# EAGLE design ac-timer (EAGLE 9.6.2)
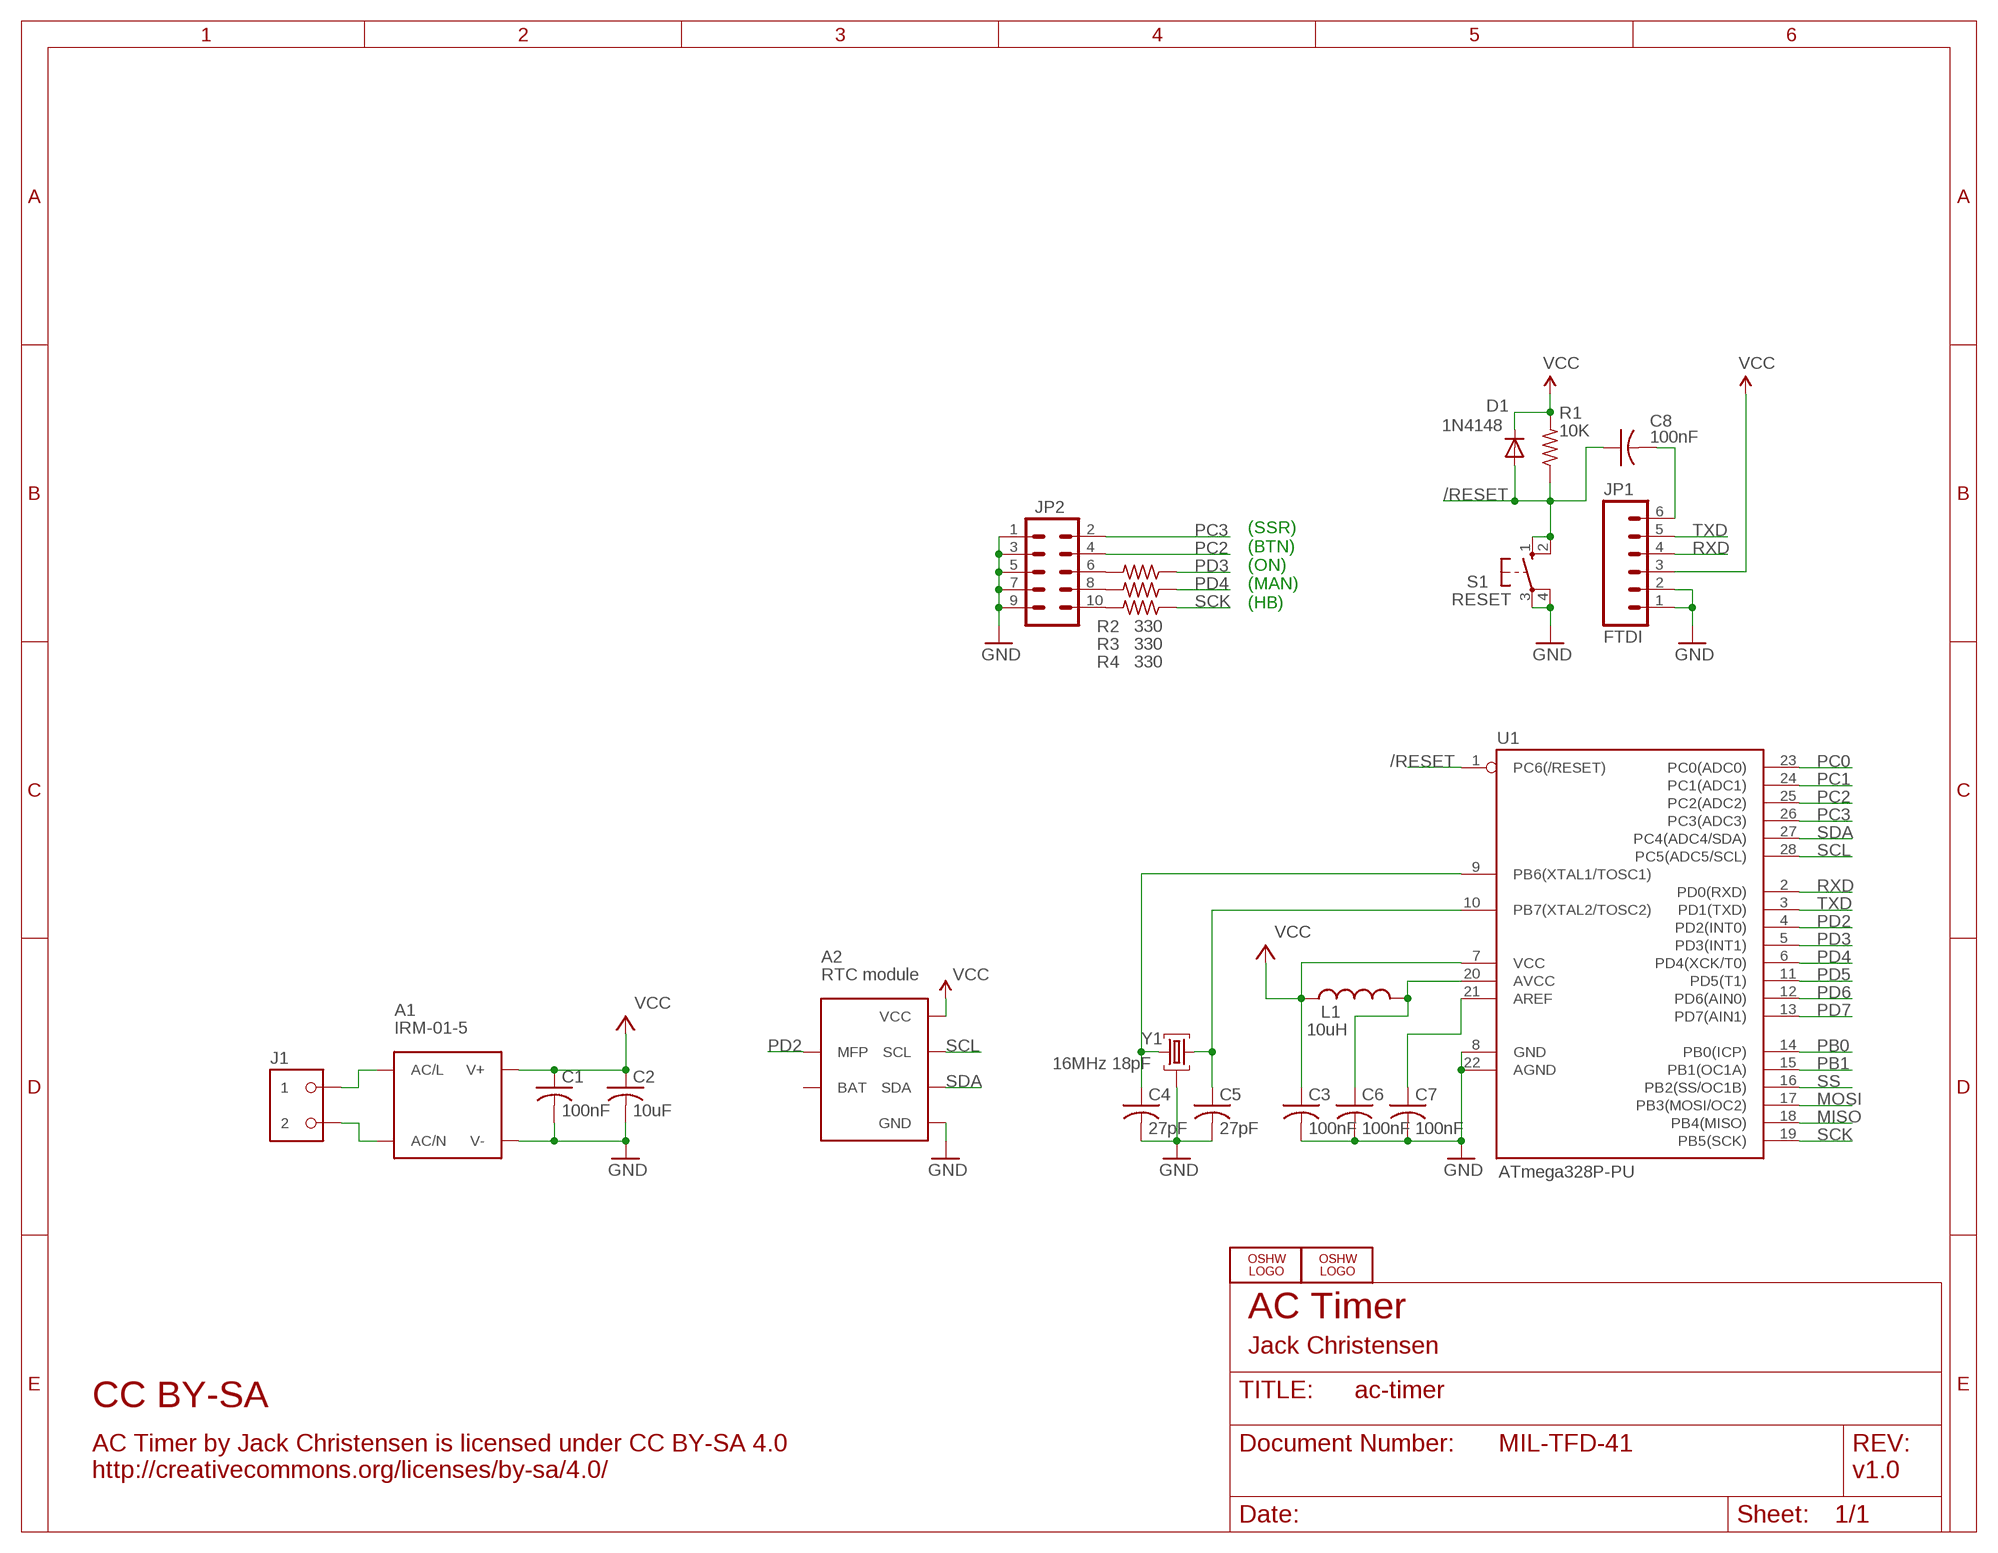
[diagram p0: schematic, sheet 1]

## Parts
A1  IRM-01-5  IRM-01  [IRM-01]
A2  RTC module  RTC79412  [RTC79412]
C1  100nF  C-USM0805  [M0805]
C2  10uF  C-USM0805  [M0805]
C3  100nF  C-USM0805  [M0805]
C4  27pF  C-USM0805  [M0805]
C5  27pF  C-USM0805  [M0805]
C6  100nF  C-USM0805  [M0805]
C7  100nF  C-USM0805  [M0805]
C8  100nF  C-USM0805  [M0805]
D1  1N4148  DIODESOD-323F  [SOD-323F]
J1  OST-TB-20.20IN  [OST-TB-2-0.20]
JP1  FTDI  M06LOCK  [1X06_LOCK]
JP2  M05X2PTH  [AVR_ICSP]
L1  10uH  INDUCTORM0805  [M0805]
LOGO1  OSHW_LOGO_8MILX0100-NT  [OSHW_8X100_NOTEXT]
LOGO2  OSHW_LOGO_8MILX0100-NT  [OSHW_8X100_NOTEXT]
R1  10K  R-US_M0805  [M0805]
R2  330  R-US_M0805  [M0805]
R3  330  R-US_M0805  [M0805]
R4  330  R-US_M0805  [M0805]
S1  RESET  10-XXOCT  [B3F-10XXOCT]
U1  ATmega328P-PU  AVR-MEGA8-PPTH  [DIL28-3]
Y1  16MHz 18pF  RESONATOR  [RESONATOR]

## Nets
/RESET: C8.1 D1.A R1.1 S1.1(S) S1.2(S1) U1.1(PC6(/RESET))
GND: A1.V- A2.8(GND) C1.2 C2.2 C3.2 C4.2 C5.2 C6.2 C7.2 JP1.1 JP1.2 JP2.1 JP2.3 JP2.5 JP2.7 JP2.9 S1.3(P) S1.4(P1) U1.8(GND) U1.22(AGND) Y1.2
MISO: U1.18(PB4(MISO))
MOSI: U1.17(PB3(MOSI/OC2))
N$1: JP2.10 R4.2
N$2: JP2.8 R3.2
N$3: JP2.6 R2.2
N$4: C5.1 U1.10(PB7(XTAL2/TOSC2)) Y1.3
N$5: C6.1 L1.2 U1.20(AVCC)
N$6: C4.1 U1.9(PB6(XTAL1/TOSC1)) Y1.1
N$7: C7.1 U1.21(AREF)
N$8: A1.AC/N J1.P$2
N$9: A1.AC/L J1.P$1
PB0: U1.14(PB0(ICP))
PB1: U1.15(PB1(OC1A))
PC0: U1.23(PC0(ADC0))
PC1: U1.24(PC1(ADC1))
PC2: JP2.4 U1.25(PC2(ADC2))
PC3: JP2.2 U1.26(PC3(ADC3))
PD2: A2.3(MFP) U1.4(PD2(INT0))
PD3: R2.1 U1.5(PD3(INT1))
PD4: R3.1 U1.6(PD4(XCK/T0))
PD5: U1.11(PD5(T1))
PD6: U1.12(PD6(AIN0))
PD7: U1.13(PD7(AIN1))
RST: C8.2 JP1.6
RXD: JP1.4 U1.2(PD0(RXD))
SCK: R4.1 U1.19(PB5(SCK))
SCL: A2.6(SCL) U1.28(PC5(ADC5/SCL))
SDA: A2.5(SDA) U1.27(PC4(ADC4/SDA))
SS: U1.16(PB2(SS/OC1B))
TXD: JP1.5 U1.3(PD1(TXD))
VCC: A1.V+ A2.7(VCC) C1.1 C2.1 C3.1 D1.K JP1.3 L1.1 R1.2 U1.7(VCC)
Unconnected: A2.1(BAT)

## Notes on the sheet
- (SSR)
  (BTN)
  (ON)
  (MAN)
  (HB)
- AC Timer
- Jack Christensen
- CC BY-SA
- MIL-TFD-41
- AC Timer by Jack Christensen is licensed under CC BY-SA 4.0
  http://creativecommons.org/licenses/by-sa/4.0/
- v1.0

## Library data of the parts
A1 = _jc:IRM-01: Mean Well IRM-01 series 1W encapsulated power supply module.
A2 = _jc:RTC79412
C1-C8 = _jc:C-US: CAPACITOR, American symbol
D1 = _jc:DIODE
J1 = _jc:OST-TB-2
JP1 = SparkFun:M06: Header 6 Standard 6-pin 0.1" header. Use with straight break away headers (SKU : PRT-00116), right angle break away headers (PRT-00553), swiss pins (PRT-00743), machine pins (PRT-00117), and female headers (PRT-00115). Molex polarized connector foot print use with SKU : PRT-08094 with associated crimp pins and housings. NOTES ON THE VARIANTS LOCK and LOCK_LONGPADS... This footprint was designed to help hold the alignment of a through-hole component (i.e. 6-pin header) while soldering it into place. You may notice that each hole has been shifted either up or down by 0.005 of an inch from it's more standard position (which is a perfectly straight line). This slight alteration caused the pins (the squares in the middle) to touch the edges of the holes. Because they are alternating, it causes a "brace" to hold the component in place. 0.005 has proven to be the perfect amount of "off-center" position when using our standard breakaway headers. Although looks a little odd when you look at the bare footprint, once you have a header in there, the alteration is very hard to notice. Also, if you push a header all the way into place, it is covered up entirely on the bottom side. This idea of altering the position of holes to aid alignment will be further integrated into the Sparkfun Library for other footprints. It can help hold any component with 3 or more connection pins.
JP2 = SparkFun:M05X2: Header 5x2 Standard 10-pin dual row 0.1" header. Commonly used with AVR-ISP. Use with Spark Fun Electronics SKU: PRT-00778
L1 = _jc:INDUCTOR: Murata #11R472C
LOGO1 LOGO2 = ohw-logo:OSHW_LOGO_8MIL
R1-R4 = _jc:R-US_: RESISTOR, American symbol
S1 = _jc:10-XX: OMRON SWITCH
U1 = SparkFun:AVR-MEGA8-P: MICROCONTROLLER 8 Kbytes FLASH 1 kbytes SRAM 512 bytes EEPROM USART 4-channel 10 bit ADC 2-channel 8 bit ADC
Y1 = _jc:RESONATOR: Ceramic resonator with capacitors or HC49/US crystal

## Board
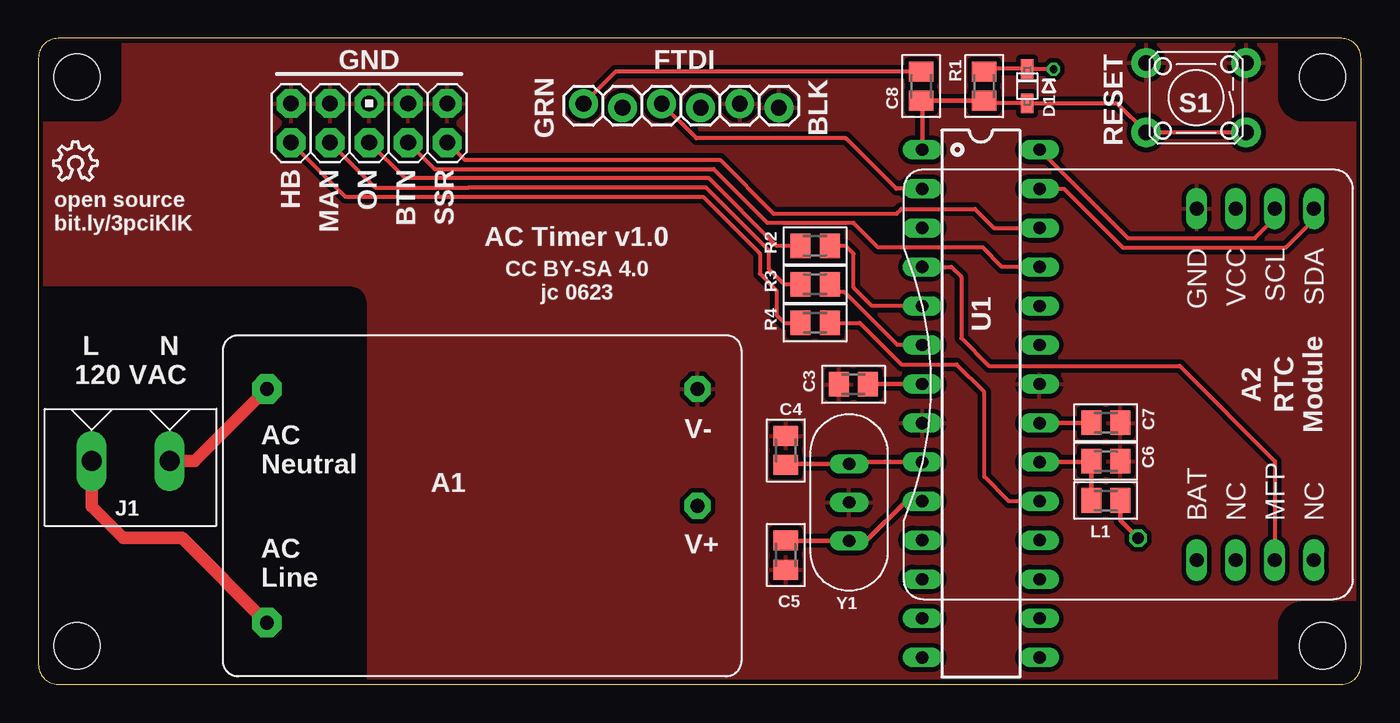
[diagram p1: board, top side]
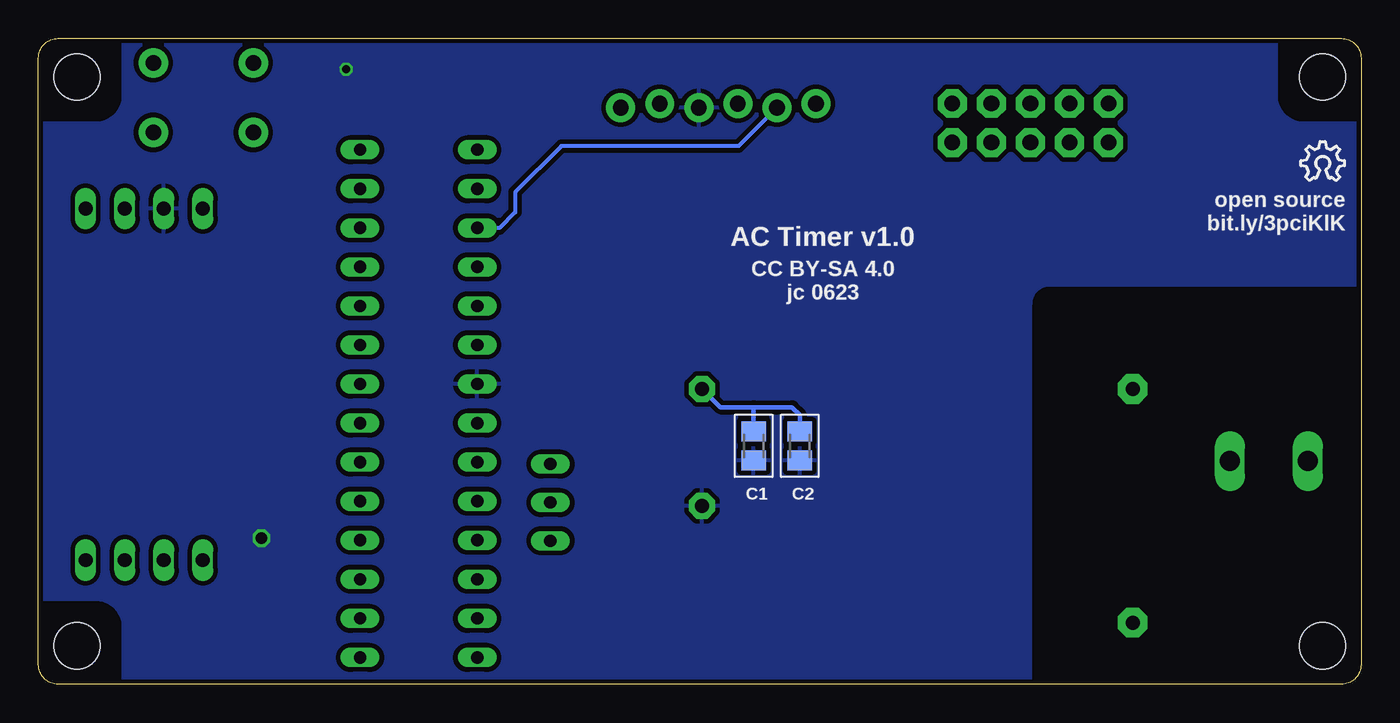
[diagram p2: board, bottom side, seen from below]

Size 86 x 42 mm. Coordinates in mm from the lower left corner, seen from the top.
Outline: 1.27,0 84.73,0 arc90 86,1.27 86,40.73 arc90 84.73,42 1.27,42 arc90 0,40.73 0,1.27 arc90 1.27,0
Copper layers (1*16): Top 0.0356mm / dielectric 1.5011mm / Bottom 0.0356mm
Design rules "oshpark-2layer-jc": minimum track width 8mil, minimum drill 13mil, track to track 8mil, track to pad 8mil, pad to pad 8mil, via to via 8mil, smd to smd 6mil, copper to edge 12mil, drill to drill 6mil, minimum pad ring 7mil, minimum via ring 7mil, stop-mask expansion 2.5mil, vias tented up to drill 20mil, thermal gap 12mil
Holes 3 mm at 2.5,2.5 2.5,39.5 83.5,39.5 83.5,2.5
tRestrict: area 81,37 to 86,42; area 81,0 to 86,5; area 0,37 to 5,42
bRestrict: area 0,37 to 5,42; area 81,0 to 86,5; area 81,37 to 86,42

### Footprints (pad centres in the part's own frame; a part is rotated, then mirrored left to right if it is on the bottom)
IRM-01 = drill 0.9 pad 1.93 octagon: AC/L 2.85,3.5; AC/N 2.85,18.7 | drill 0.9 pad 1.676 octagon: V+ 30.85,11.1; V- 30.85,18.7
RTC79412 = drill 0.9 long: 1 -11.43,-3.81; 2 -11.43,-6.35; 3 -11.43,-8.89; 4 -11.43,-11.43; 5 11.43,-11.43; 6 11.43,-8.89; 7 11.43,-6.35; 8 11.43,-3.81
M0805 = smd 1.3 x 1.6: 1 -0.95,0; 2 0.95,0
SOD-323F = smd 1.27 x 0.813: A -1.118,0; K 1.118,0
OST-TB-2-0.20 = drill 1.3 long: P$1 2.548,-0.009; P$2 -2.532,-0.009
1X06_LOCK = drill 1.016 pad 1.88: 1 0,0; 2 2.54,-0.254; 3 5.08,0; 4 7.62,-0.254; 5 10.16,0; 6 12.7,-0.254
AVR_ICSP = drill 1.016 pad 1.88 octagon: 1 -1.27,5.08; 2 1.27,5.08; 3 -1.27,2.54; 4 1.27,2.54; 5 -1.27,0; 6 1.27,0; 7 -1.27,-2.54; 8 1.27,-2.54; 9 -1.27,-5.08; 10 1.27,-5.08
B3F-10XXOCT = drill 1.016 pad 1.93: 1 -3.251,2.261; 2 3.251,2.261; 3 -3.251,-2.261; 4 3.251,-2.261
DIL28-3 = drill 0.8 pad 1.27 long: 1 -16.51,-3.81; 2 -13.97,-3.81; 3 -11.43,-3.81; 4 -8.89,-3.81; 5 -6.35,-3.81; 6 -3.81,-3.81; 7 -1.27,-3.81; 8 1.27,-3.81; 9 3.81,-3.81; 10 6.35,-3.81; 11 8.89,-3.81; 12 11.43,-3.81; 13 13.97,-3.81; 14 16.51,-3.81; 15 16.51,3.81; 16 13.97,3.81; 17 11.43,3.81; 18 8.89,3.81; 19 6.35,3.81; 20 3.81,3.81; 21 1.27,3.81; 22 -1.27,3.81; 23 -3.81,3.81; 24 -6.35,3.81; 25 -8.89,3.81; 26 -11.43,3.81; 27 -13.97,3.81; 28 -16.51,3.81
RESONATOR = drill 0.8 pad 1.27 long: 1 -2.5,0; 2 0,0; 3 2.5,0

### Placement (x,y rotation side)
A1  12,0.5 0 top
A2  71.5,19.5 90 top
C1  39.5,15.5 90 bottom
C2  36.5,15.5 90 bottom
C3  53,19.5 180 top
C4  48.6,15.2 90 top
C5  48.6,8.4 270 top
C6  69.4,14.5 0 top
C7  69.4,17 0 top
C8  57.4,38.9 90 top
D1  64.3,38.9 90 top
J1  6,14.5 180 top
JP1  48.14,37.5 180 top
JP2  21.5,36.5 270 top
L1  69.4,11.95 180 top
LOGO1  0.99,32.76 0 top
LOGO2  3.91,32.76 0 bottom
R1  61.5,38.9 90 top
R2  50.5,28.5 180 top
R3  50.5,26 180 top
R4  50.5,23.5 180 top
S1  75.28,38.15 180 top
U1  61.28,18.25 270 top
Y1  52.71,11.82 270 top

### Tracks (layer width: path | path; a pad name or v marks a point on that pad's centre or on a via)
/RESET
  Top 0.254: R1.1 61.67,37.78 D1.A 70.14,37.78 S1.2 S1.1
  Top 0.305: U1.1 57.47,37.88 C8.1 R1.1
GND
  Bottom 0.305: A1.V- 41.65,18 39.5,18 | C2.2 36.5,17.5 37,18 39.5,18 | C1.2 39.5,18
  pour Top (isolate 0.305): -1,43 87,43 87,-1 21.5,-1 21.5,24.73 arc90 20.23,26 -1,26
N$1
  Top 0.254: JP2.10 19.95,31.7 43.2,31.7 46.9,28 46.9,26.7 48,25.6 48,24 48.5,23.5 R4.2
N$2
  Top 0.254: JP2.8 21.89,32.3 27,32.3 28,32.3 43.4,32.3 47.5,28.2 47.5,27 48.5,26 R3.2
N$3
  Top 0.254: JP2.6 23.83,32.9 43.6,32.9 48,28.5 R2.2
N$4
  Top 0.305: U1.10 56.4,11.9 53.82,9.32 Y1.3 48.63,9.32 C5.1
N$5
  Top 0.305: L1.2 C6.1 68.39,14.44 U1.20
N$6
  Top 0.305: U1.9 52.83,14.44 Y1.1 48.67,14.32 C4.1
N$7
  Top 0.305: U1.21 65.11,17 C7.1
N$8
  Top 0.813: A1.AC/N 10.16,14.51 J1.P$2
N$9
  Top 0.813: A1.AC/L 9.35,9.5 5.5,9.5 3.45,11.55 J1.P$1
PC2
  Top 0.254: U1.25 62.66,27.14 61.4,28.4 54.6,28.4 53,30 47.4,30 43.9,33.5 25.77,33.5 JP2.4
PC3
  Top 0.254: JP2.2 27.71,34.1 44.3,34.1 47.8,30.6 55.8,30.6 56.1,30.9 60.9,30.9 62.12,29.68 U1.26
PD2
  Top 0.254: U1.4 59.36,27.14 60,26.5 60,22.5 61.8,20.7 74.2,20.7 80.4,14.5 A2.3
PD3
  Top 0.254: U1.5 54.2,24.6 53,25.8 53,28 52.5,28.5 R2.1
PD4
  Top 0.254: U1.6 55.84,22.06 52.4,25.5 51.5,25.5 51.45,25.55 R3.1
RST
  Top 0.254: C8.2 37.54,39.85 JP1.6
RXD
  Top 0.254: U1.2 55.78,32.22 52.5,35.5 42.77,35.5 JP1.4
SCK
  Top 0.254: U1.19 63.1,11.9 61.5,13.5 61.5,19 59.7,20.8 56.1,20.8 53.4,23.5 R4.1
SCL
  Top 0.254: U1.28 70.85,29 79.1,29 80.4,30.3 A2.6
SDA
  Top 0.254: U1.27 66.68,32.22 70.5,28.4 81.1,28.4 82.93,30.23 A2.5
TXD
  Bottom 0.254: JP1.5 40.48,35 52,35 55,32 55,30.7 56.02,29.68 U1.3
VCC  (via drill 0.5, 0.75)
  Top 0.254: R1.2 61.67,40.02 D1.K 64.32,40 v66,40
  Top 0.305: U1.7 53.97,19.52 C3.1 | v71.5,9.5 70.35,10.65 L1.1
  pour Bottom (isolate 0.305): -1.5,43.5 87.5,43.5 87.5,-1.5 21.5,-1.5 21.5,24.73 arc90 20.23,26 -1.5,26

### Text on the board
tPlace: GND | FTDI | GRN | BLK | RESET | HB | MAN | ON | BTN | SSR | open source / bit.ly/3pciKlK | AC Timer v1.0 | CC BY-SA 4.0 / jc 0623 | L N / 120 VAC | RTC / Module
bPlace: open source / bit.ly/3pciKlK | AC Timer v1.0 | CC BY-SA 4.0 / jc 0623